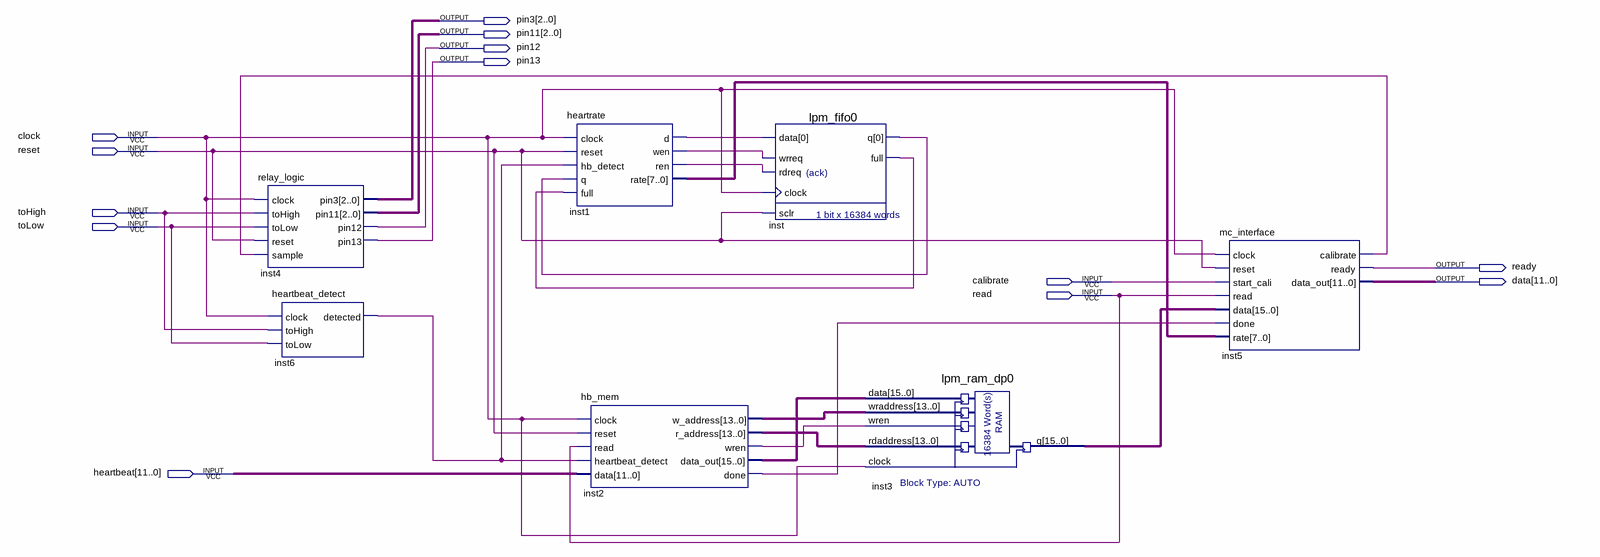
[diagram p0: schematic sheet]
// Quartus schematic ECG.bdf as structural Verilog: 7 symbols, 13 pins
module ECG (
  input  clock,
  input  reset,
  input  toHigh,
  input  toLow,
  input  calibrate,
  input  read,
  input  [11:0] heartbeat,
  output [2:0] pin3,
  output [2:0] pin11,
  output pin12,
  output pin13,
  output ready,
  output [11:0] data
);

  wire inst1_d, inst1_ren, inst1_wen, inst2_done, inst2_wren, inst5_calibrate, inst6_detected, inst_full,
       inst_q;
  wire [7:0] inst1_rate;
  wire [13:0] inst2_r_address, inst2_w_address;
  wire [15:0] inst2_data_out, inst3_q;

  relay_logic inst4 (
    .clock(clock), .toHigh(toHigh), .toLow(toLow), .reset(reset), .sample(inst5_calibrate), .pin3(pin3),
    .pin11(pin11), .pin12(pin12), .pin13(pin13));
  heartbeat_detect inst6 (.clock(clock), .toHigh(toHigh), .toLow(toLow), .detected(inst6_detected));
  heartrate inst1 (
    .clock(clock), .reset(reset), .hb_detect(inst6_detected), .q(inst_q), .full(inst_full), .d(inst1_d),
    .wen(inst1_wen), .ren(inst1_ren), .rate(inst1_rate));
  hb_mem inst2 (
    .clock(clock), .reset(reset), .read(read), .heartbeat_detect(inst6_detected), .data(heartbeat),
    .w_address(inst2_w_address), .r_address(inst2_r_address), .wren(inst2_wren), .data_out(inst2_data_out),
    .done(inst2_done));
  lpm_fifo0 inst (
    .data(inst1_d), .wrreq(inst1_wen), .rdreq(inst1_ren), .clock(clock), .sclr(reset), .q(inst_q),
    .full(inst_full));
  lpm_ram_dp0 inst3 (
    .data(inst2_data_out), .wraddress(inst2_w_address), .wren(inst2_wren), .rdaddress(inst2_r_address),
    .clock(clock), .q(inst3_q));
  mc_interface inst5 (
    .clock(clock), .reset(reset), .start_cali(calibrate), .read(read), .data(inst3_q), .done(inst2_done),
    .rate(inst1_rate), .calibrate(inst5_calibrate), .ready(ready), .data_out(data));
endmodule
